# EAGLE design date2-shift-r1 (EAGLE 6.5.0)
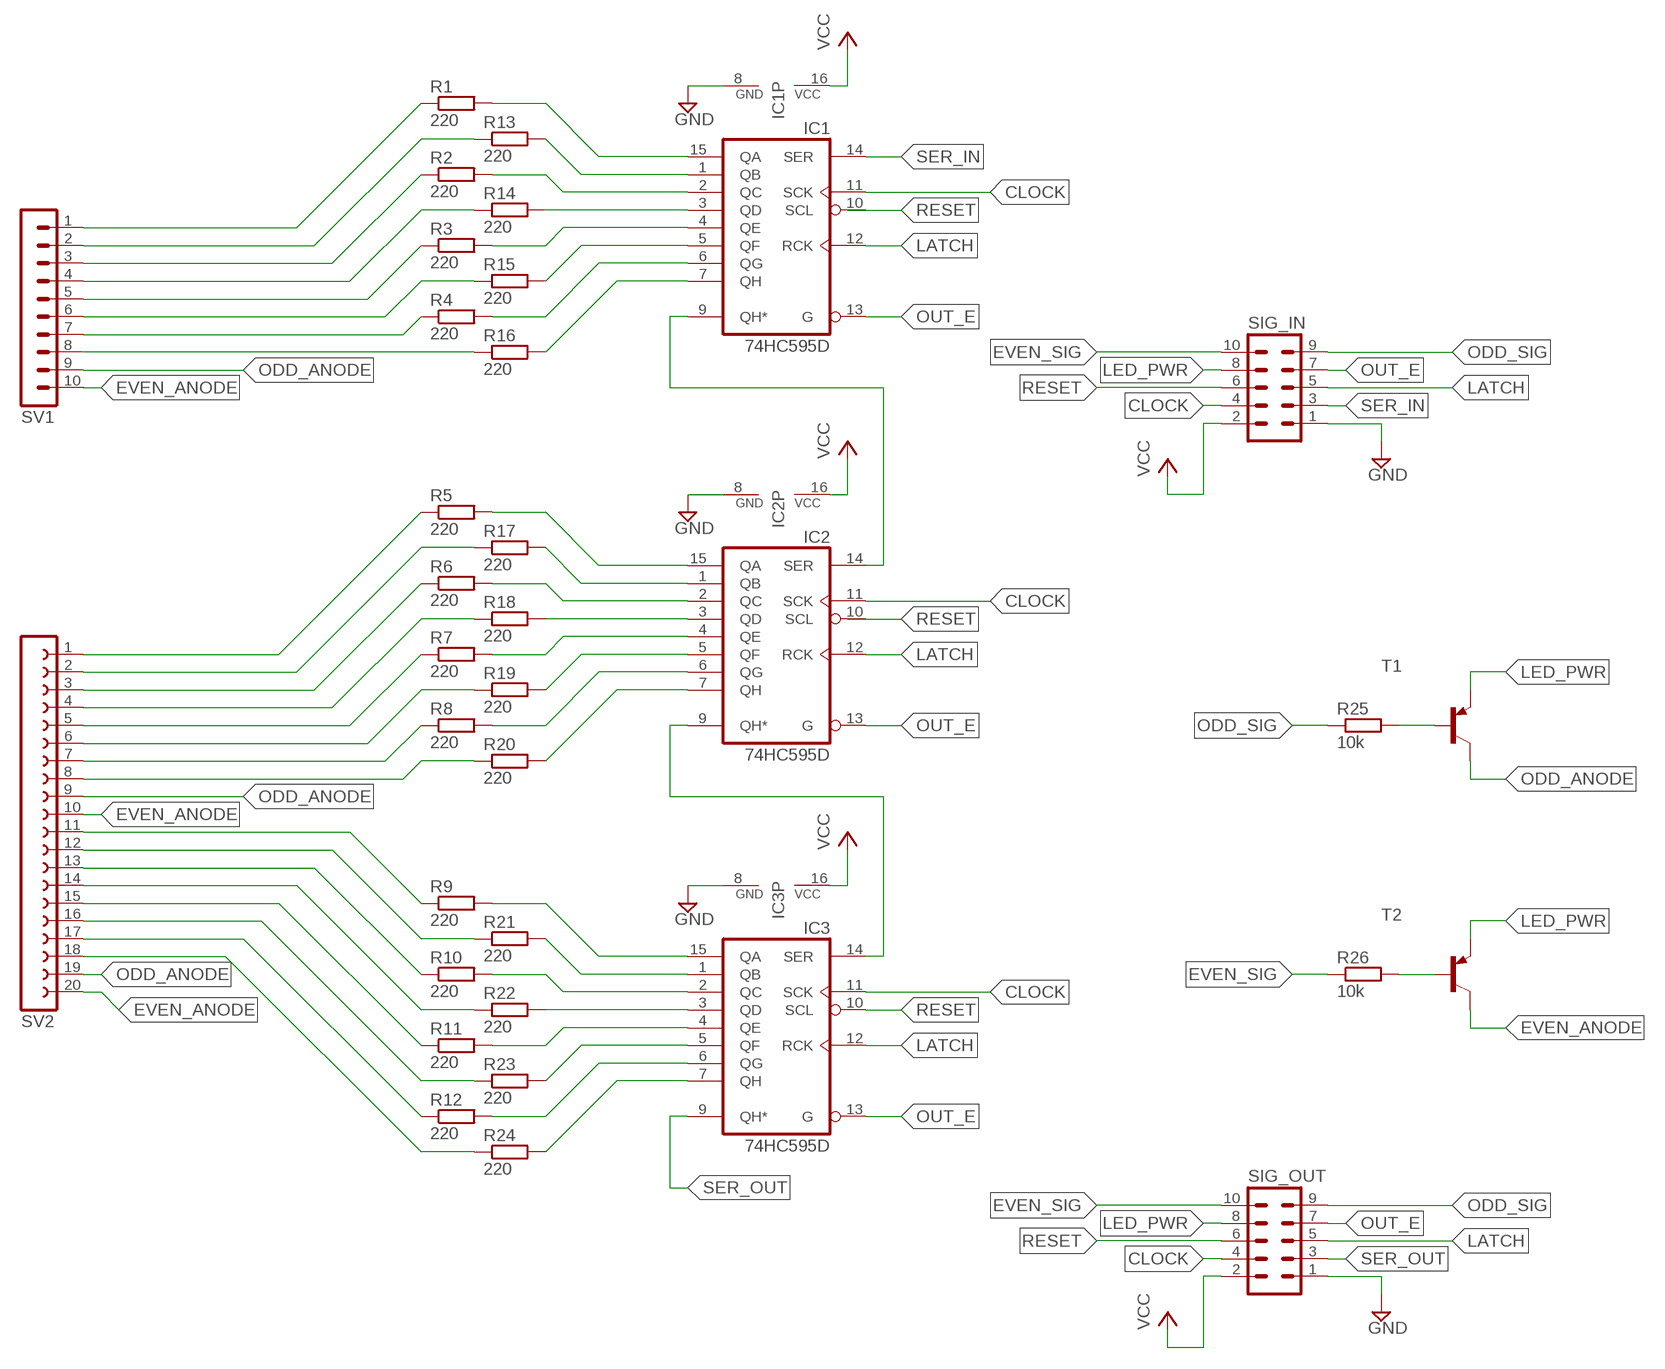
[diagram p0: schematic, sheet 1]

## Parts
IC1  74HC595D  [SO16]
IC2  74HC595D  [SO16]
IC3  74HC595D  [SO16]
R1  220  R-EU_R0805  [R0805]
R2  220  R-EU_R0805  [R0805]
R3  220  R-EU_R0805  [R0805]
R4  220  R-EU_R0805  [R0805]
R5  220  R-EU_R0805  [R0805]
R6  220  R-EU_R0805  [R0805]
R7  220  R-EU_R0805  [R0805]
R8  220  R-EU_R0805  [R0805]
R9  220  R-EU_R0805  [R0805]
R10  220  R-EU_R0805  [R0805]
R11  220  R-EU_R0805  [R0805]
R12  220  R-EU_R0805  [R0805]
R13  220  R-EU_R0805  [R0805]
R14  220  R-EU_R0805  [R0805]
R15  220  R-EU_R0805  [R0805]
R16  220  R-EU_R0805  [R0805]
R17  220  R-EU_R0805  [R0805]
R18  220  R-EU_R0805  [R0805]
R19  220  R-EU_R0805  [R0805]
R20  220  R-EU_R0805  [R0805]
R21  220  R-EU_R0805  [R0805]
R22  220  R-EU_R0805  [R0805]
R23  220  R-EU_R0805  [R0805]
R24  220  R-EU_R0805  [R0805]
R25  10k  R-EU_R0805  [R0805]
R26  10k  R-EU_R0805  [R0805]
SIG_IN  MA05-2  [MA05-2]
SIG_OUT  MA05-2  [MA05-2]
SV1  MA10-1  [MA10-1]
SV2  FE20-1  [FE20]
T1  BC557B-PNP-TO92-EBC  [TO92-EBC]
T2  BC557B-PNP-TO92-EBC  [TO92-EBC]

## Nets
CLOCK: IC1.11(SCK) IC2.11(SCK) IC3.11(SCK) SIG_IN.4 SIG_OUT.4
EVEN_ANODE: SV1.10 SV2.10 SV2.20 T2.C
EVEN_SIG: R26.1 SIG_IN.10 SIG_OUT.10
GND: IC1.8(GND) IC2.8(GND) IC3.8(GND) SIG_IN.1 SIG_OUT.1
LATCH: IC1.12(RCK) IC2.12(RCK) IC3.12(RCK) SIG_IN.5 SIG_OUT.5
LED_PWR: SIG_IN.8 SIG_OUT.8 T1.E T2.E
N$1: IC2.15(QA) R5.2
N$2: IC2.2(QC) R6.2
N$3: IC2.4(QE) R7.2
N$4: IC2.6(QG) R8.2
N$5: R20.1 SV2.8
N$6: R19.1 SV2.6
N$7: R18.1 SV2.4
N$8: R17.1 SV2.2
N$9: IC2.1(QB) R17.2
N$10: IC2.3(QD) R18.2
N$11: IC2.5(QF) R19.2
N$12: IC2.7(QH) R20.2
N$13: IC3.15(QA) R9.2
N$14: IC3.2(QC) R10.2
N$15: IC3.4(QE) R11.2
N$16: IC3.6(QG) R12.2
N$17: R24.1 SV2.18
N$18: R23.1 SV2.16
N$19: R22.1 SV2.14
N$20: R21.1 SV2.12
N$21: IC3.1(QB) R21.2
N$22: IC3.3(QD) R22.2
N$23: IC3.5(QF) R23.2
N$24: IC3.7(QH) R24.2
N$25: IC2.9(QH*) IC3.14(SER)
N$26: R5.1 SV2.1
N$27: R6.1 SV2.3
N$28: R7.1 SV2.5
N$29: R8.1 SV2.7
N$30: R9.1 SV2.11
N$31: R10.1 SV2.13
N$32: R11.1 SV2.15
N$33: R12.1 SV2.17
N$36: IC1.15(QA) R1.2
N$37: IC1.2(QC) R2.2
N$38: IC1.4(QE) R3.2
N$39: IC1.6(QG) R4.2
N$40: R16.1 SV1.8
N$41: R4.1 SV1.7
N$42: R3.1 SV1.5
N$43: R13.1 SV1.2
N$44: IC1.1(QB) R13.2
N$45: IC1.3(QD) R14.2
N$46: IC1.5(QF) R15.2
N$47: IC1.7(QH) R16.2
N$48: IC1.9(QH*) IC2.14(SER)
N$49: R14.1 SV1.4
N$50: R2.1 SV1.3
N$51: R1.1 SV1.1
N$52: R15.1 SV1.6
N$53: R26.2 T2.B
N$54: R25.2 T1.B
ODD_ANODE: SV1.9 SV2.9 SV2.19 T1.C
ODD_SIG: R25.1 SIG_IN.9 SIG_OUT.9
OUT_E: IC1.13(G) IC2.13(G) IC3.13(G) SIG_IN.7 SIG_OUT.7
RESET: IC3.10(SCL) SIG_IN.6 SIG_OUT.6
SER_IN: IC1.14(SER) SIG_IN.3
SER_OUT: IC3.9(QH*) SIG_OUT.3
VCC: IC1.16(VCC) IC2.16(VCC) IC3.16(VCC) SIG_IN.2 SIG_OUT.2
Unconnected: IC1.10(SCL) IC2.10(SCL)

## Library data of the parts
IC1-IC3 = 74xx-eu:74*595: 8-bit SHIFT REGISTER, output latch
R1-R26 = rcl:R-EU_: RESISTOR, European symbol
SIG_IN SIG_OUT = con-lstb:MA05-2: PIN HEADER; OC_FARNELL: unknown; OC_NEWARK: unknown
SV1 = con-lstb:MA10-1: PIN HEADER; OC_FARNELL: unknown; OC_NEWARK: unknown
SV2 = con-lsta:FE20-1: FEMALE HEADER; OC_FARNELL: unknown; OC_NEWARK: unknown
T1 T2 = transistor:*-PNP-: PNP Transistror

## Board
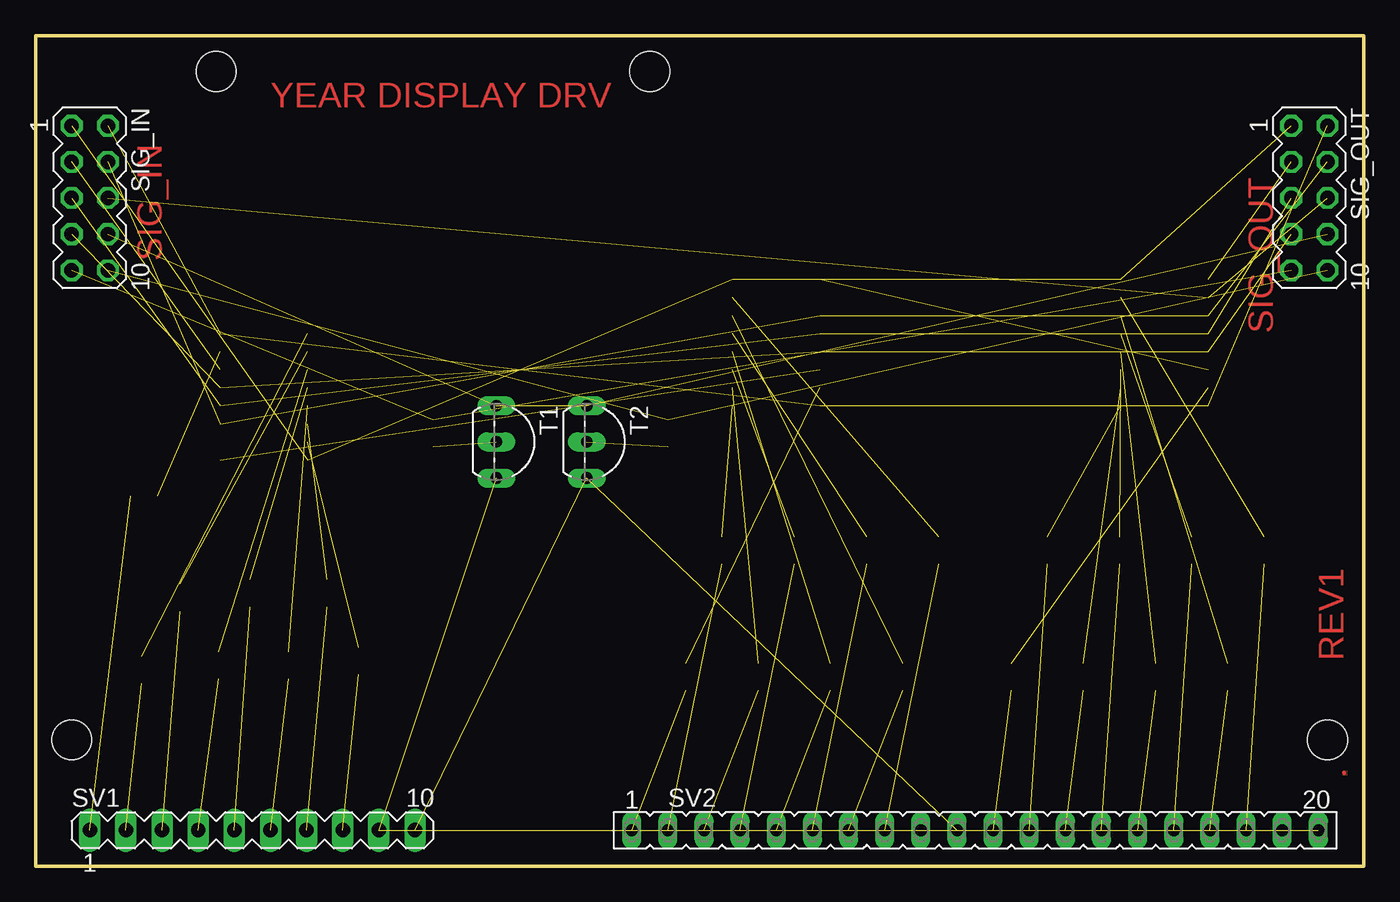
[diagram p1: board, top side]
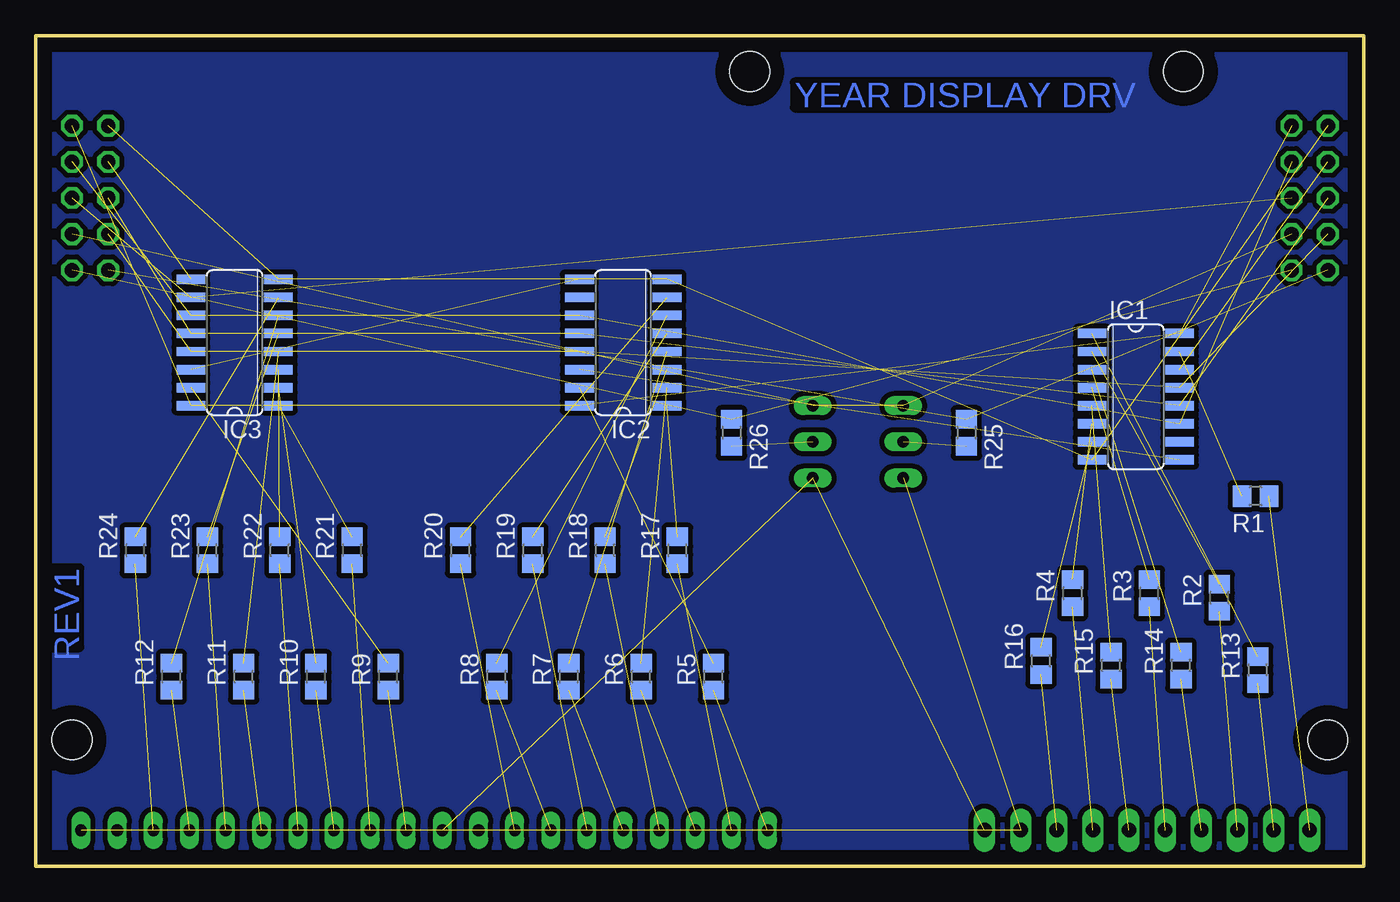
[diagram p2: board, bottom side, seen from below]

Size 93.37 x 58.41 mm. Coordinates in mm from the lower left corner, seen from the top.
Outline: 0,0 93.37,0 93.37,58.41 0,58.41 0,0
Copper layers (1*16): Top 0.035mm / dielectric 1.5mm / Bottom 0.035mm
Design rules "default *": minimum track width 10mil, minimum drill 24mil, track to track 14mil, track to pad 14mil, pad to pad 14mil, via to via 14mil, smd to smd 14mil, copper to edge 40mil, drill to drill 8mil, minimum pad ring 10mil, minimum via ring 8mil, stop-mask expansion 4mil, vias tented up to drill 0mil, thermal gap 10mil
Holes 2.8 mm at 12.7,55.88 43.18,55.88 2.54,8.89 90.81,8.89
tRestrict: area 39.4,1.3 to 92.7,6.3; area 1.3,38.1 to 6.3,58.4; area 87,38.1 to 92.1,58.4; area 49.5,30.5 to 54.6,43.2; area 76.8,30.5 to 81.9,43.2; area 36.2,26 to 41.9,33.7; area 29.8,26 to 35.6,33.7; area 1.3,1.3 to 29.2,6.3; area 10.2,30.5 to 22.9,35.6

### Footprints (pad centres in the part's own frame; a part is rotated, then mirrored left to right if it is on the bottom)
SO16 = smd 0.66 x 2.032: 1 -4.445,-3.073; 2 -3.175,-3.073; 3 -1.905,-3.073; 4 -0.635,-3.073; 5 0.635,-3.073; 6 1.905,-3.073; 7 3.175,-3.073; 8 4.445,-3.073; 9 4.445,3.073; 10 3.175,3.073; 11 1.905,3.073; 12 0.635,3.073; 13 -0.635,3.073; 14 -1.905,3.073; 15 -3.175,3.073; 16 -4.445,3.073
R0805 = smd 1.3 x 1.5: 1 -0.95,0; 2 0.95,0
MA05-2 = drill 1.016 octagon: 1 -5.08,-1.27; 2 -5.08,1.27; 3 -2.54,-1.27; 4 -2.54,1.27; 5 0,-1.27; 6 0,1.27; 7 2.54,-1.27; 8 2.54,1.27; 9 5.08,-1.27; 10 5.08,1.27
MA10-1 = drill 1.016 long: 1 -11.43,0; 2 -8.89,0; 3 -6.35,0; 4 -3.81,0; 5 -1.27,0; 6 1.27,0; 7 3.81,0; 8 6.35,0; 9 8.89,0; 10 11.43,0
FE20 = drill 0.813 long: 1 -24.13,0; 2 -21.59,0; 3 -19.05,0; 4 -16.51,0; 5 -13.97,0; 6 -11.43,0; 7 -8.89,0; 8 -6.35,0; 9 -3.81,0; 10 -1.27,0; 11 1.27,0; 12 3.81,0; 13 6.35,0; 14 8.89,0; 15 11.43,0; 16 13.97,0; 17 16.51,0; 18 19.05,0; 19 21.59,0; 20 24.13,0
TO92-EBC = drill 0.813 long: B 0,-1.27; C 2.54,-1.27; E -2.54,-1.27

### Placement (x,y rotation side)
IC1  16.03,33.02 270 bottom
IC2  52.07,36.83 90 bottom
IC3  79.38,36.83 90 bottom
R1  7.62,26.04 180 bottom
R2  10.16,18.89 90 bottom
R3  15.08,19.21 90 bottom
R4  20.48,19.21 90 bottom
R5  45.72,13.34 90 bottom
R6  50.8,13.34 90 bottom
R7  55.88,13.34 90 bottom
R8  60.96,13.34 90 bottom
R9  68.58,13.34 90 bottom
R10  73.66,13.34 90 bottom
R11  78.74,13.34 90 bottom
R12  83.82,13.34 90 bottom
R13  7.46,13.81 90 bottom
R14  12.86,14.13 90 bottom
R15  17.78,14.13 90 bottom
R16  22.7,14.45 90 bottom
R17  48.26,22.23 90 bottom
R18  53.34,22.23 90 bottom
R19  58.42,22.23 90 bottom
R20  63.5,22.23 90 bottom
R21  71.12,22.23 90 bottom
R22  76.2,22.23 90 bottom
R23  81.28,22.23 90 bottom
R24  86.36,22.23 90 bottom
R25  27.94,30.48 270 bottom
R26  44.45,30.48 270 bottom
SIG_IN  3.81,46.99 270 top
SIG_OUT  89.53,46.99 270 top
SV1  15.24,2.54 0 top
SV2  66.04,2.54 0 top
T1  33.66,29.84 270 top
T2  40.01,29.84 270 top

### Tracks (layer width: path | path; a pad name or v marks a point on that pad's centre or on a via)
CLOCK  (4 unrouted)
EVEN_ANODE  (3 unrouted)
EVEN_SIG  (2 unrouted)
GND  (4 unrouted)
LATCH  (4 unrouted)
LED_PWR  (3 unrouted)
N$1  (1 unrouted)
N$2  (1 unrouted)
N$3  (1 unrouted)
N$4  (1 unrouted)
N$5  (1 unrouted)
N$6  (1 unrouted)
N$7  (1 unrouted)
N$8  (1 unrouted)
N$9  (1 unrouted)
N$10  (1 unrouted)
N$11  (1 unrouted)
N$12  (1 unrouted)
N$13  (1 unrouted)
N$14  (1 unrouted)
N$15  (1 unrouted)
N$16  (1 unrouted)
N$17  (1 unrouted)
N$18  (1 unrouted)
N$19  (1 unrouted)
N$20  (1 unrouted)
N$21  (1 unrouted)
N$22  (1 unrouted)
N$23  (1 unrouted)
N$24  (1 unrouted)
N$25  (1 unrouted)
N$26  (1 unrouted)
N$27  (1 unrouted)
N$28  (1 unrouted)
N$29  (1 unrouted)
N$30  (1 unrouted)
N$31  (1 unrouted)
N$32  (1 unrouted)
N$33  (1 unrouted)
N$34
  pour Bottom: 0,58.42 93.34,58.42 93.34,-0.64 0,-0.64
N$35
  Top 0.254: 91.95,6.6 92,6.55
  pour Top: -2.54,59.69 93.34,58.42 94.61,-1.27 -2.54,-2.54
N$36  (1 unrouted)
N$37  (1 unrouted)
N$38  (1 unrouted)
N$39  (1 unrouted)
N$40  (1 unrouted)
N$41  (1 unrouted)
N$42  (1 unrouted)
N$43  (1 unrouted)
N$44  (1 unrouted)
N$45  (1 unrouted)
N$46  (1 unrouted)
N$47  (1 unrouted)
N$48  (1 unrouted)
N$49  (1 unrouted)
N$50  (1 unrouted)
N$51  (1 unrouted)
N$52  (1 unrouted)
N$53  (1 unrouted)
N$54  (1 unrouted)
ODD_ANODE  (3 unrouted)
ODD_SIG  (2 unrouted)
OUT_E  (4 unrouted)
RESET  (2 unrouted)
SER_IN  (1 unrouted)
SER_OUT  (1 unrouted)
VCC  (4 unrouted)

### Text on the board
Top: YEAR DISPLAY DRV | SIG_IN | SIG_OUT | REV1
Bottom: YEAR DISPLAY DRV | REV1